# EAGLE design LED_bar (EAGLE 7.1.0)
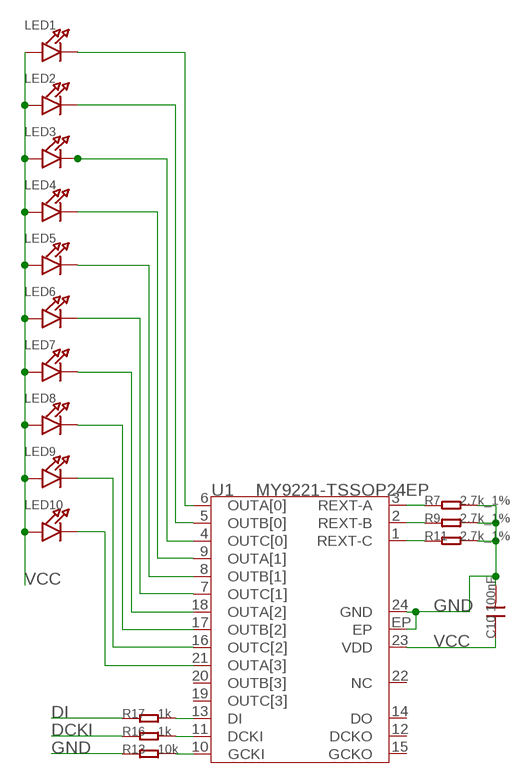
[diagram p0: schematic, sheet 1]

## Parts
C10  100nF  C-0603  [0603]
LED1  LED0805  [CHIPLED_0805]
LED2  LED0805  [CHIPLED_0805]
LED3  LED0805  [CHIPLED_0805]
LED4  LED0805  [CHIPLED_0805]
LED5  LED0805  [CHIPLED_0805]
LED6  LED0805  [CHIPLED_0805]
LED7  LED0805  [CHIPLED_0805]
LED8  LED0805  [CHIPLED_0805]
LED9  LED0805  [CHIPLED_0805]
LED10  LED0805  [CHIPLED_0805]
R7  2.7k_1%  R-0603  [0603]
R9  2.7k_1%  R-0603  [0603]
R11  2.7k_1%  R-0603  [0603]
R13  10k  R-0603  [0603]
R16  1k  R-0603  [0603]
R17  1k  R-0603  [0603]
U1  MY9221-TSSOP24EP  [TSSOP24EP]

## Nets
DCKI: R16.1
DI: R17.1
GND: C10.2 R7.2 R9.2 R11.2 R13.1 U1.24(GND) U1.EP
LED-1: LED1.C U1.6(OUTA[0])
LED-2: LED2.C U1.5(OUTB[0])
LED-3: LED3.C U1.4(OUTC[0])
LED-7: LED7.C U1.18(OUTA[2])
LED-8: LED8.C U1.17(OUTB[2])
LED-10: LED10.C U1.21(OUTA[3])
N$1: R17.2 U1.13(DI)
N$2: R16.2 U1.11(DCKI)
N$4: R13.2 U1.10(GCKI)
N$7: R11.1 U1.1(REXT-C)
N$8: R9.1 U1.2(REXT-B)
N$9: R7.1 U1.3(REXT-A)
N$10: LED9.C U1.16(OUTC[2])
N$11: LED4.C U1.9(OUTA[1])
N$12: LED5.C U1.8(OUTB[1])
N$13: LED6.C U1.7(OUTC[1])
VCC: C10.1 LED1.A LED2.A LED3.A LED4.A LED5.A LED6.A LED7.A LED8.A LED9.A LED10.A U1.23(VDD)
Unconnected: U1.12(DCKO) U1.14(DO) U1.15(GCKO) U1.19(OUTC[3]) U1.20(OUTB[3]) U1.22(NC)

## Library data of the parts
C10 = Discrete:C*: Ceramic Capacitors
LED1-LED10 = microbuilder:LED: LED 0603 - 0603 Surface Mount Package 2mA: Green LED - Low Power (3.9mcd, 2ma, 1.7Vf) - Digikey: 475-2709-2-ND Orange LED - Low Power (9.8mcd, 2ma, 1.8Vf) - Digikey: 475-1194-2-ND Red LED - Low Power (5mcd, 2ma, 1.8Vf) - Digikey: 475-1195-2-ND Yellow LED - Low Power (7mcd, 2ma, 1.8Vf) - Digikey: 475-1196-2-ND 5mA: Blue LED - Low Power (17mcd, 5ma, 2.9Vf) - Digikey: LNJ937W8CRACT-ND 0805 - 0805 Surface Mount Package 2mA: Red LED (8.8mcd, 2mA, 1.8Vf, Clear) - Low Power [Digikey: 475-2510-1-ND] Green LED (5mcd, 2mA, 1.8Vf, Clear) - Low Power [Digikey: 475-2730-1-ND] Yellow LED (11.3mcd, 2mA, 1.8Vf, Clear) - Low Power [Digikey: 475-2555-1-ND] 20mA: Red LED (104mcd, 20mA, Diffused) - LS R976 [Digikey: 475-1278-6-ND] Red LED (12mcd, 20mA, 2.0Vf, Clear) - APT2012EC [Digikey: 754-1128-1-ND] Green LED (15mcd, 20mA, 2.2Vf, Clear) - APT2012GC [Digikey: 754-1131-1-ND] Orange LED (160mcd, 20mA, 2.1Vf, Clear) - APT2012SECK [Digikey: 754-1130-1-ND] 1206 - 1206 Surface Mount Package Green LED (26mcd, 20mA, Diffused) - LG N971 [Digikey: 475-1407-6-ND] Red LED (15mcd, 20mA, Diffused) - LH N974 [Digikey: 475-1416-6-ND]
R7 R9 R11 R13 R16 R17 = Discrete:R*
U1 = For_Test_Albert:MY9221

## Net classes
0 default: width 0.203 mm, drill 0.305 mm, clearance 0.152 mm

## Board
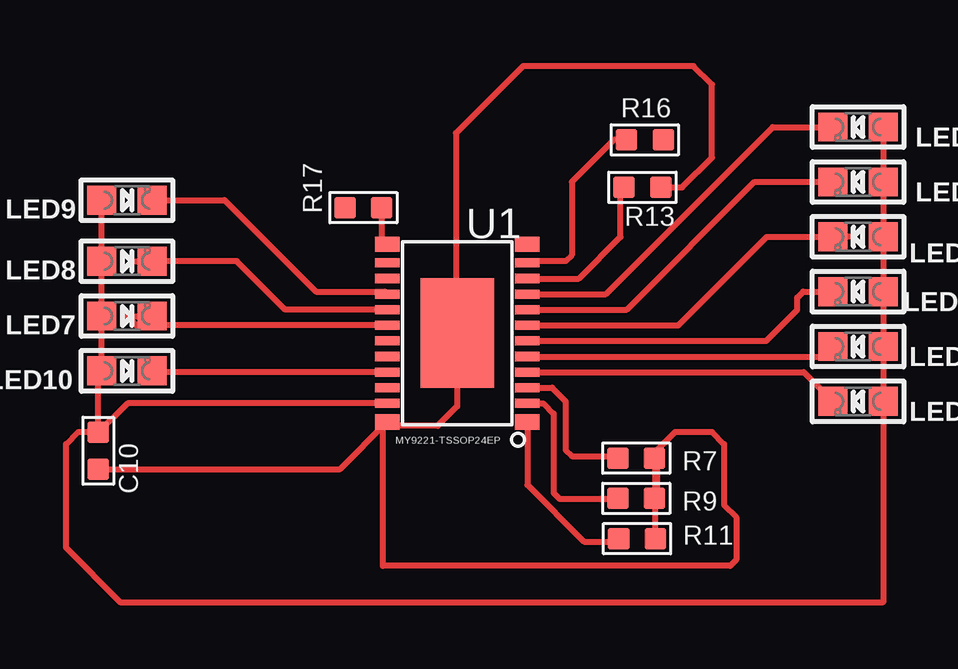
[diagram p1: board, top side]

No outline drawn. Coordinates in mm, seen from the top.
Copper layers (1*16): Top 0.035mm / dielectric 1.5mm / Bottom 0.035mm
Design rules "default": minimum track width 10mil, minimum drill 12mil, track to track 8mil, track to pad 8mil, pad to pad 8mil, via to via 8mil, smd to smd 8mil, copper to edge 15mil, drill to drill 8mil, minimum pad ring 10mil, minimum via ring 8mil, stop-mask expansion 4mil, vias tented up to drill 25mil, thermal gap 10mil

### Footprints (pad centres in the part's own frame; a part is rotated, then mirrored left to right if it is on the bottom)
0603 = smd 0.889 x 0.889: 1 -0.762,0; 2 0.762,0
CHIPLED_0805 = smd 1.2 x 1.2: A 0,-1.05; C 0,1.05
TSSOP24EP = smd 0.635 x 1.016: 1 -3.702,-2.921; 12 3.702,-2.921; 13 3.702,2.921; 24 -3.702,2.921 | smd 0.381 x 1.016: 2 -2.925,-2.921; 3 -2.275,-2.921; 4 -1.625,-2.921; 5 -0.975,-2.921; 6 -0.325,-2.921; 7 0.325,-2.921; 8 0.975,-2.921; 9 1.625,-2.921; 10 2.275,-2.921; 11 2.925,-2.921; 14 2.925,2.921; 15 2.275,2.921; 16 1.625,2.921; 17 0.975,2.921; 18 0.325,2.921; 19 -0.325,2.921; 20 -0.975,2.921; 21 -1.625,2.921; 22 -2.275,2.921; 23 -2.925,2.921 | smd 4.572 x 3.048: EP 0,0

### Placement (x,y rotation side)
C10  57.23,16.23 270 top
LED1  88.9,22.86 90 top
LED2  88.9,20.57 90 top
LED3  88.9,18.29 90 top
LED4  88.9,29.72 90 top
LED5  88.9,27.43 90 top
LED6  88.9,25.15 90 top
LED7  58.42,21.84 270 top
LED8  58.42,24.13 270 top
LED9  58.42,26.67 270 top
LED10  58.42,19.56 270 top
R7  79.65,15.93 0 top
R9  79.65,14.25 0 top
R11  79.68,12.57 0 top
R13  79.91,27.2 180 top
R16  80.01,29.18 180 top
R17  68.28,26.37 0 top
U1  72.19,21.13 90 top

### Tracks (layer width: path | path; a pad name or v marks a point on that pad's centre or on a via)
GND
  Top 0.254: R11.2 80.44,15.9 R7.2 | R7.2 80.42,15.85 80.52,15.75 80.52,14.35 R9.2 | R7.2 80.42,16.15 81.28,17.02 82.8,17.02 83.31,16.51 83.31,13.97 83.82,13.46 83.82,11.68 83.57,11.43 69.09,11.43 69.09,17.25 U1.24 | C10.2 67.3,15.47 U1.24 | U1.EP 72.19,20.57 | 72.19,20.57 72.19,18.09 71.37,17.27 69.42,17.27 U1.24 | R13.1 81.56,27.2 82.8,28.45 82.8,31.5 82.04,32.26 74.93,32.26 72.14,29.46 72.14,20.62 72.19,20.57
LED-1
  Top 0.254: U1.6 85.07,20.81 86.36,22.1 86.36,22.61 86.61,22.86 LED1.C
LED-2
  Top 0.254: U1.5 87.43,20.16 LED2.C
LED-3
  Top 0.254: U1.4 86.63,19.51 LED3.C
LED-7
  Top 0.254: U1.18 58.81,21.46 58.42,21.84 LED7.C
LED-8
  Top 0.254: U1.17 65.01,22.11 62.99,24.13 LED8.C 58.67,24.13
LED-10
  Top 0.254: U1.21 59.52,19.51 LED10.C
N$1
  Top 0.254: R17.2 69.04,25.06 U1.13
N$2
  Top 0.254: R16.2 78.72,29.18 76.96,27.43 76.96,24.38 76.71,24.13 75.18,24.13 U1.11
N$4
  Top 0.254: U1.10 77.26,23.41 78.99,25.15 78.99,27.05 R13.2
N$7
  Top 0.254: U1.1 75.11,14.81 77.47,12.45 78.79,12.45 R11.1
N$8
  Top 0.254: U1.2 75.77,18.21 76.2,17.78 76.2,14.48 76.45,14.22 78.87,14.22 R9.1
N$9
  Top 0.254: U1.3 76.14,18.86 76.71,18.29 76.71,16.26 76.96,16 78.82,16 R7.1
N$10
  Top 0.254: LED9.C 62.48,26.67 66.29,22.86 69.16,22.86 U1.16
N$11
  Top 0.254: U1.9 78.38,22.76 85.34,29.72 LED4.C
N$12
  Top 0.254: U1.8 79.26,22.11 84.58,27.43 LED5.C
N$13
  Top 0.254: U1.7 81.4,21.46 85.09,25.15 LED6.C 88.65,25.15
VCC
  Top 0.254: U1.23 58.44,18.21 C10.1 | C10.1 57.23,19.41 LED10.A LED7.A LED8.A LED9.A | LED4.A LED5.A LED6.A LED1.A LED2.A LED3.A 89.95,9.94 89.92,9.91 58.17,9.91 55.88,12.19 55.88,16.51 56.39,17.02 57.2,17.02 C10.1

### Text on the board
tPlace: durer canon etching / based on LED Bar
tNames: MY9221-TSSOP24EP